# Altium schematic sheet LCL.SchDoc: NIC POWER LCL prototype
size A4; DrawnBy: Marcin Bieda, Daniel Kaczmara; Revision: 1.0
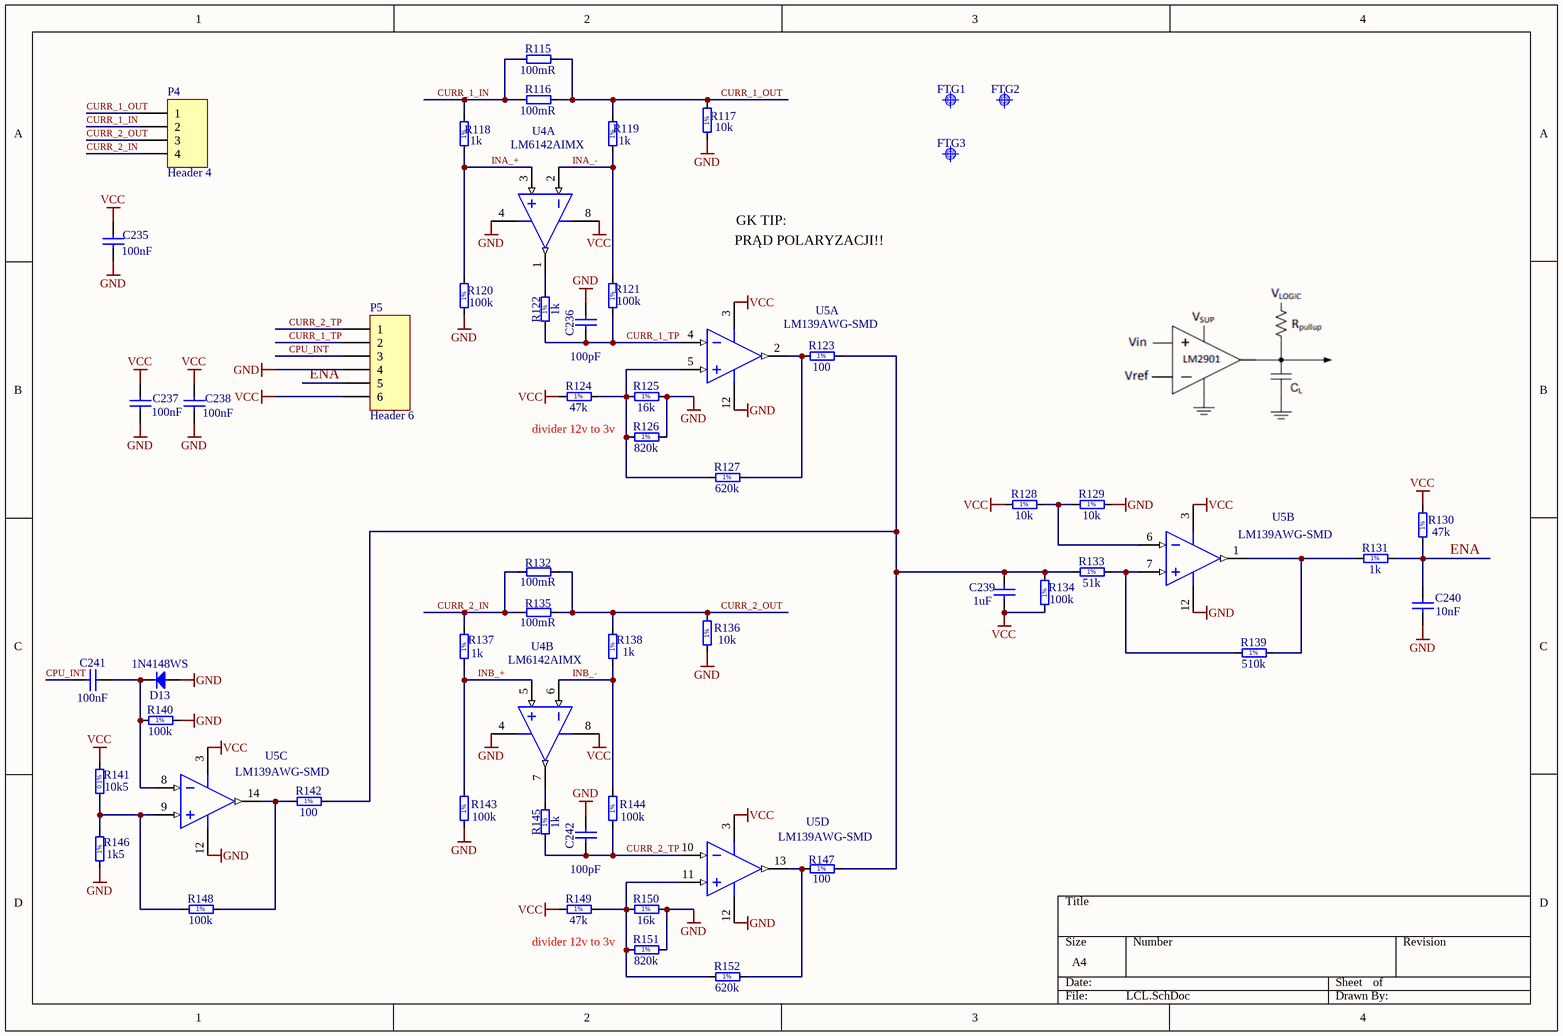
[diagram p0: LCL.SchDoc]

## Parts
C235  100nF  [CAPC1608X87N]
C236  100pF  [CAPC1608X87N]
C237  100nF  [CAPC1608X87N]
C238  100nF  [CAPC1608X87N]
C239  1uF  [CAPC1608X87N]
C240  10nF  [CAPC1608X87N]
C241  100nF  [CAPC1608X87N]
C242  100pF  [CAPC1608X87N]
D13  1N4148WS  [SODFL2512X100N]
FTG1  Use only in PCB  [FIDUCIAL_TOP_C100-200]  (value not drawn)
FTG2  Use only in PCB  [FIDUCIAL_TOP_C100-200]  (value not drawn)
FTG3  Use only in PCB  [FIDUCIAL_TOP_C100-200]  (value not drawn)
P4  Header 4  [1x4 Header 2mm male]
P5  Header 6  [2x3 Header 2mm male]
R115  100mR  [RESC1608X55N]
R116  100mR  [RESC1608X55N]
R117  10k  [RESC1608X55N]
R118  1k  [RESC1608X55N]
R119  1k  [RESC1608X55N]
R120  100k  [RESC1608X55N]
R121  100k  [RESC1608X55N]
R122  1k  [RESC1608X55N]
R123  100  [RESC1608X55N]
R124  47k  [RESC1608X55N]
R125  16k  [RESC1608X55N]
R126  820k  [RESC1608X55N]
R127  620k  [RESC1608X55N]
R128  10k  [RESC1608X55N]
R129  10k  [RESC1608X55N]
R130  47k  [RESC1608X55N]
R131  1k  [RESC1608X55N]
R132  100mR  [RESC1608X55N]
R133  51k  [RESC1608X55N]
R134  100k  [RESC1608X55N]
R135  100mR  [RESC1608X55N]
R136  10k  [RESC1608X55N]
R137  1k  [RESC1608X55N]
R138  1k  [RESC1608X55N]
R139  510k  [RESC1608X55N]
R140  100k  [RESC1608X55N]
R141  10k5  [RESC1608X55N]
R142  100  [RESC1608X55N]
R143  100k  [RESC1608X55N]
R144  100k  [RESC1608X55N]
R145  1k  [RESC1608X55N]
R146  1k5  [RESC1608X55N]
R147  100  [RESC1608X55N]
R148  100k  [RESC1608X55N]
R149  47k  [RESC1608X55N]
R150  16k  [RESC1608X55N]
R151  820k  [RESC1608X55N]
R152  620k  [RESC1608X55N]
U4  LM6142AIMX  [M08A_N]  (parts A,B of 2)
U5  LM139AWG-SMD  [WG14A_N]  (parts A,B,C,D of 4)

## Nets
GND: C235.1 C236.2 C237.1 C238.1 C240.1 C242.2 D13.2(A) P5.4 R117.1 R120.1 R125.2 R126.2 R129.2 R136.1 R140.2 R143.1 R146.1 R150.2 R151.2 U4.4(V-) U5.12(GND)
VCC: C235.2 C237.2 C238.2 C239.1 P5.6 R124.1 R128.1 R130.2 R134.1 R141.2 R149.1 U4.8(V+) U5.3(V+)
CPU_INT: C241.1 P5.3
CURR_1_IN: P4.2 R115.1 R116.1 R118.2
CURR_1_OUT: P4.1 R115.2 R116.2 R117.2 R119.2
CURR_1_TP: C236.1 P5.2 R121.1 R122.1 U5.4(IN1-)
CURR_2_IN: P4.4 R132.1 R135.1 R137.2
CURR_2_OUT: P4.3 R132.2 R135.2 R136.2 R138.2
CURR_2_TP: C242.1 P5.1 R144.1 R145.1 U5.10(IN4-)
ENA: C240.2 P5.5 R130.1 R131.2
INA_+: R118.1 R120.2 U4.3(INA+)
INA_-: R119.1 R121.2 U4.2(INA-)
INB_+: R137.1 R143.2 U4.5(INB+)
INB_-: R138.1 R144.2 U4.6(INB-)
NetC239_2: C239.2 R123.2 R133.1 R134.2 R142.2 R147.2
NetC241_2: C241.2 D13.1(C) R140.1 U5.8(IN3-)
NetR122_2: R122.2 U4.1(OUTA)
NetR123_1: R123.1 R127.2 U5.2(OUT1)
NetR124_2: R124.2 R125.1 R126.1 R127.1 U5.5(IN1+)
NetR128_2: R128.2 R129.1 U5.6(IN2-)
NetR131_1: R131.1 R139.2 U5.1(OUT2)
NetR133_2: R133.2 R139.1 U5.7(IN2+)
NetR141_1: R141.1 R146.2 R148.1 U5.9(IN3+)
NetR142_1: R142.1 R148.2 U5.14(OUT3)
NetR145_2: R145.2 U4.7(OUTB)
NetR147_1: R147.1 R152.2 U5.13(OUT4)
NetR149_2: R149.2 R150.1 R151.1 R152.1 U5.11(IN4+)

## Notes on the sheet
- PRĄD POLARYZACJI!!
- GK TIP:
- (near R126) divider 12v to 3v
- (near R151) divider 12v to 3v
- (in symbol R0603_1K5_1%_0.1W_100PPM) 1%
- (in symbol R0603_1K_1%_0.1W_100PPM) 1%
- (in symbol R0603_10K5_0.1%_0.063W_10PPM) 0.1%
- (in symbol R0603_10K_1%_0.1W_100PPM) 1%
- (in symbol R0603_16K_1%_0.1W_100PPM) 1%
- (in symbol R0603_47K_1%_0.1W_100PPM) 1%
- (in symbol R0603_51K_1%_0.1W_100PPM) 1%
- (in symbol R0603_100K_1%_0.1W_100PPM) 1%
- (in symbol R0603_100R_1%_0.1W_100PPM) 1%
- (in symbol R0603_510K_1%_0.1W_100PPM) 1%
- (in symbol R0603_620K_1%_0.1W_100PPM) 1%
- (in symbol R0603_820K_1%_0.1W_100PPM) 1%

## Library data of the parts
C235 C237 C238 C241 = CC0603_100NF_50V_10%_X7R: Non-polarised capacitor; Part Description: SMD Multilayer Chip Ceramic Capacitor; Manufacturer: GENERIC; Manufacturer1 Part Number: 223858615649; Voltage: 50V; TC: X7R; Tolerance: ±10%; Part Number: CC0603_100NF_50V_10%_X7R; Component Kind: Standard; Component Type: Standard; Pin Count: 2; Value: 100nF; Status: Preferred; Manufacturer Part Number: CC0603_100NF_50V_10%_X7R; Case: 0603; Mounted: Yes; Socket: No; SMD: Yes; Sense: No; Manufacturer1 Example: PHYCOMP; Manufacturer1 ComponentHeight: 0.87mm; HelpURL: \\cern.ch\dfs\Applications\Altium\Datasheets\CC0603_X7R_PHYCOMP.pdf; Author: CERN DEM JLC; CreateDate: 2007-12-03; LatestRevisionDate: 2007-12-03
C236 C242 = CC0603_100PF_50V_10%_X7R: Non-polarised capacitor; Part Description: SMD Multilayer Chip Ceramic Capacitor; Manufacturer: GENERIC; Manufacturer1 Part Number: 223858615609; Voltage: 50V; TC: X7R; Tolerance: ±10%; Part Number: CC0603_100PF_50V_10%_X7R; Component Kind: Standard; Component Type: Standard; Pin Count: 2; Value: 100pF; Status: Preferred; Manufacturer Part Number: CC0603_100PF_50V_10%_X7R; Case: 0603; Mounted: Yes; Socket: No; SMD: Yes; Sense: No; Manufacturer1 Example: PHYCOMP; Manufacturer1 ComponentHeight: 0.9mm; HelpURL: \\cern.ch\dfs\Applications\Altium\Datasheets\CC0603_X7R_PHYCOMP.pdf; Author: CERN DEM JLC; CreateDate: 2012-08-15; LatestRevisionDate: 2012-08-15
C239 = CC0603_1UF_25V_10%_X7R: Non-polarised capacitor; Part Description: SMD Multilayer Chip Ceramic Capacitor; Manufacturer: GENERIC; Manufacturer1 Part Number: GRM188R71E105KA12D; Voltage: 25V; TC: X7R; Tolerance: ±10%; Part Number: CC0603_1UF_25V_10%_X7R; Component Kind: Standard; Component Type: Standard; Pin Count: 2; Value: 1uF; Status: None; Manufacturer Part Number: CC0603_1UF_25V_10%_X7R; Case: 0603; Mounted: Yes; Socket: No; SMD: Yes; Sense: No; Manufacturer1 Example: MURATA; Manufacturer1 ComponentHeight: 0.9mm; HelpURL: \\cern.ch\dfs\Applications\Altium\Datasheets\CC0603_X7R_MURATA.pdf; Author: CERN DEM JLC; CreateDate: 2011-01-18; LatestRevisionDate: 2011-01-18
C240 = CC0603_10NF_50V_10%_X7R: Non-polarised capacitor; Part Description: SMD Multilayer Chip Ceramic Capacitor; Manufacturer: GENERIC; Manufacturer1 Part Number: 223858615636; Voltage: 50V; TC: X7R; Tolerance: ±10%; Part Number: CC0603_10NF_50V_10%_X7R; Component Kind: Standard; Component Type: Standard; Pin Count: 2; Value: 10nF; Status: Preferred; Manufacturer Part Number: CC0603_10NF_50V_10%_X7R; Case: 0603; Mounted: Yes; Socket: No; SMD: Yes; Sense: No; Manufacturer1 Example: PHYCOMP; Manufacturer1 ComponentHeight: 0.87mm; HelpURL: \\cern.ch\dfs\Applications\Altium\Datasheets\CC0603_X7R_PHYCOMP.pdf; Author: CERN DEM JLC; CreateDate: 2007-12-03; LatestRevisionDate: 2007-12-03
D13 = 1N4148WS: Diode; Part Description: Small Signal Diodes; Manufacturer: FAIRCHILD SEMICONDUCTOR; Voltage: 75V; Power: 150mA; PressFit: No; Bonding: No; Part Number: 1N4148WS; Component Kind: Standard; Component Type: Standard; Device: 1N4148WS; PackageDescription: SODFL Diode; 1.70mm W X 1.25mm L X 1.00mm H body, IPC Medium Density; Manufacturer Part Number: 1N4148WS; Pin Count: 2; Case: SOD-323F; Mounted: Yes; Socket: No; SMD: Yes; Sense: No; ComponentHeight: 1mm; HelpURL: \\cern.ch\dfs\Applications\Altium\Datasheets\1N4148WS.pdf; Author: CERN DEM JLC; CreateDate: 2011-05-12; LatestRevisionDate: 2011-05-12
FTG1-FTG3 = FIDUCIAL_TARGET_C100-200: Fiducial Target; Part Description: Round Fiducial Target, Top Layer, 1.0mm, Top Solder 2.0mm, Keepout =2.0mm; Mounted: No; Part Number: FIDUCIAL_TARGET_C100-200; Component Kind: Standard (No BOM); Component Type: Standard (No BOM); Pin Count: 1; Family: Fiducial; Socket: No; SMD: Yes; Sense: No; Status: None; ComponentHeight: 0mm; HelpURL: Undefined; Author: CERN DEM JLC; CreateDate: 2010-02-09; LatestRevisionDate: 2012-04-04; PackageDescription: Round Fiducial Target, Top Layer, 1.0mm, Top Solder 2.0mm, Keepout =2.0mm
P4 = Header 4: Header, 4-Pin; LatestRevisionDate: 17-Jul-2002; LatestRevisionNote: Re-released for DXP Platform.; Publisher: Altium Limited
P5 = Header 6: Header, 6-Pin; LatestRevisionDate: 17-Jul-2002; LatestRevisionNote: Re-released for DXP Platform.; Publisher: Altium Limited
R115 R116 R132 R135 = R0603_0R_JUMPER: Resistor; Part Number: 100mR 0603; Part Description: 1A (0.05R Max DC Resistance) Zero Ohm Jumper; Manufacturer: GENERIC; Manufacturer1 Part Number: NRC06Z0; Value: 0; PressFit: No; Component Kind: Standard; Component Type: Standard; Pin Count: 2; Status: Preferred; Manufacturer Part Number: R0603_0R_JUMPER; Case: 0603; Mounted: Yes; Sense: No; Socket: No; SMD: Yes; Manufacturer1 Example: NIC COMPONENT; Manufacturer1 ComponentHeight: 0.55mm; HelpURL: \\cern.ch\dfs\Applications\Altium\Datasheets\R0603_NIC_NRC.pdf; Author: CERN DEM JLC; CreateDate: 2007-12-03; LatestRevisionDate: 2008-03-13
R117 R128 R129 R136 = R0603_10K_1%_0.1W_100PPM: Resistor - 1%; Part Description: General Purpose Thick Film Chip Resistor; Manufacturer: GENERIC; Manufacturer1 Part Number: NRC06F1002TRF; Power: 0.1W; TC: ±100ppm/°C; PressFit: No; Part Number: R0603_10K_1%_0.1W_100PPM; Component Kind: Standard; Component Type: Standard; Pin Count: 2; Value: 10k; Status: Preferred; Tolerance: ±1%; Manufacturer Part Number: R0603_10K_1%_0.1W_100PPM; Case: 0603; Mounted: Yes; Sense: No; Socket: No; SMD: Yes; Manufacturer1 Example: NIC COMPONENT; Manufacturer1 ComponentHeight: 0.55mm; HelpURL: \\cern.ch\dfs\Applications\Altium\Datasheets\R0603_NIC_NRC.pdf; Author: CERN DEM JLC; CreateDate: 2007-12-03; LatestRevisionDate: 2008-03-13
R118 R119 R122 R131 R137 R138 R145 = R0603_1K_1%_0.1W_100PPM: Resistor - 1%; Part Description: General Purpose Thick Film Chip Resistor; Manufacturer: GENERIC; Manufacturer1 Part Number: NRC06F1001TRF; Power: 0.1W; TC: ±100ppm/°C; PressFit: No; Part Number: R0603_1K_1%_0.1W_100PPM; Component Kind: Standard; Component Type: Standard; Pin Count: 2; Value: 1k; Status: Preferred; Tolerance: ±1%; Manufacturer Part Number: R0603_1K_1%_0.1W_100PPM; Case: 0603; Mounted: Yes; Sense: No; Socket: No; SMD: Yes; Manufacturer1 Example: NIC COMPONENT; Manufacturer1 ComponentHeight: 0.55mm; HelpURL: \\cern.ch\dfs\Applications\Altium\Datasheets\R0603_NIC_NRC.pdf; Author: CERN DEM JLC; CreateDate: 2007-12-03; LatestRevisionDate: 2008-03-13
R120 R121 R134 R140 R143 R144 R148 = R0603_100K_1%_0.1W_100PPM: Resistor - 1%; Part Description: General Purpose Thick Film Chip Resistor; Manufacturer: GENERIC; Manufacturer1 Part Number: NRC06F1003TRF; Power: 0.1W; TC: ±100ppm/°C; PressFit: No; Part Number: R0603_100K_1%_0.1W_100PPM; Component Kind: Standard; Component Type: Standard; Pin Count: 2; Value: 100k; Status: Preferred; Tolerance: ±1%; Manufacturer Part Number: R0603_100K_1%_0.1W_100PPM; Case: 0603; Mounted: Yes; Sense: No; Socket: No; SMD: Yes; Manufacturer1 Example: NIC COMPONENT; Manufacturer1 ComponentHeight: 0.55mm; HelpURL: \\cern.ch\dfs\Applications\Altium\Datasheets\R0603_NIC_NRC.pdf; Author: CERN DEM JLC; CreateDate: 2007-12-03; LatestRevisionDate: 2008-03-13
R123 R142 R147 = R0603_100R_1%_0.1W_100PPM: Resistor - 1%; Part Description: General Purpose Thick Film Chip Resistor; Manufacturer: GENERIC; Manufacturer1 Part Number: NRC06F4700TRF; Power: 0.1W; TC: ±100ppm/°C; PressFit: No; Part Number: R0603_100R_1%_0.1W_100PPM; Component Kind: Standard; Component Type: Standard; Pin Count: 2; Value: 100; Status: Preferred; Tolerance: ±1%; Manufacturer Part Number: R0603_100R_1%_0.1W_100PPM; Case: 0603; Mounted: Yes; Sense: No; Socket: No; SMD: Yes; Manufacturer1 Example: NIC COMPONENT; Manufacturer1 ComponentHeight: 0.55mm; HelpURL: \\cern.ch\dfs\Applications\Altium\Datasheets\R0603_NIC_NRC.pdf; Author: CERN DEM JLC; CreateDate: 2007-12-03; LatestRevisionDate: 2008-03-13
R124 R130 R149 = R0603_47K_1%_0.1W_100PPM: Resistor - 1%; Part Description: General Purpose Thick Film Chip Resistor; Manufacturer: GENERIC; Manufacturer1 Part Number: NRC06F4702TRF; Power: 0.1W; TC: ±100ppm/°C; PressFit: No; Part Number: R0603_47K_1%_0.1W_100PPM; Component Kind: Standard; Component Type: Standard; Pin Count: 2; Value: 47k; Status: Preferred; Tolerance: ±1%; Manufacturer Part Number: R0603_47K_1%_0.1W_100PPM; Case: 0603; Mounted: Yes; Sense: No; Socket: No; SMD: Yes; Manufacturer1 Example: NIC COMPONENT; Manufacturer1 ComponentHeight: 0.55mm; HelpURL: \\cern.ch\dfs\Applications\Altium\Datasheets\R0603_NIC_NRC.pdf; Author: CERN DEM JLC; CreateDate: 2007-12-03; LatestRevisionDate: 2008-03-13
R125 R150 = R0603_16K_1%_0.1W_100PPM: Resistor - 1%; Part Description: General Purpose Thick Film Chip Resistor; Manufacturer: GENERIC; Manufacturer1 Part Number: NRC06F1602TRF; Power: 0.1W; TC: ±100ppm/°C; PressFit: No; Part Number: R0603_16K_1%_0.1W_100PPM; Component Kind: Standard; Component Type: Standard; Pin Count: 2; Value: 16k; Status: Preferred; Tolerance: ±1%; Manufacturer Part Number: R0603_16K_1%_0.1W_100PPM; Case: 0603; Mounted: Yes; Sense: No; Socket: No; SMD: Yes; Manufacturer1 Example: NIC COMPONENT; Manufacturer1 ComponentHeight: 0.55mm; HelpURL: \\cern.ch\dfs\Applications\Altium\Datasheets\R0603_NIC_NRC.pdf; Author: CERN DEM JLC; CreateDate: 2007-12-03; LatestRevisionDate: 2008-03-13
R126 R151 = R0603_820K_1%_0.1W_100PPM: Resistor - 1%; Part Description: General Purpose Thick Film Chip Resistor; Manufacturer: GENERIC; Manufacturer1 Part Number: NRC06F8203TRF; Power: 0.1W; TC: ±100ppm/°C; PressFit: No; Part Number: R0603_820K_1%_0.1W_100PPM; Component Kind: Standard; Component Type: Standard; Pin Count: 2; Value: 820k; Status: Preferred; Tolerance: ±1%; Manufacturer Part Number: R0603_820K_1%_0.1W_100PPM; Case: 0603; Mounted: Yes; Sense: No; Socket: No; SMD: Yes; Manufacturer1 Example: NIC COMPONENT; Manufacturer1 ComponentHeight: 0.55mm; HelpURL: \\cern.ch\dfs\Applications\Altium\Datasheets\R0603_NIC_NRC.pdf; Author: CERN DEM JLC; CreateDate: 2007-12-03; LatestRevisionDate: 2008-03-13
R127 R152 = R0603_620K_1%_0.1W_100PPM: Resistor - 1%; Part Description: General Purpose Thick Film Chip Resistor; Manufacturer: GENERIC; Manufacturer1 Part Number: NRC06F6203TRF; Power: 0.1W; TC: ±100ppm/°C; PressFit: No; Part Number: R0603_620K_1%_0.1W_100PPM; Component Kind: Standard; Component Type: Standard; Pin Count: 2; Value: 620k; Status: Preferred; Tolerance: ±1%; Manufacturer Part Number: R0603_620K_1%_0.1W_100PPM; Case: 0603; Mounted: Yes; Sense: No; Socket: No; SMD: Yes; Manufacturer1 Example: NIC COMPONENT; Manufacturer1 ComponentHeight: 0.55mm; HelpURL: \\cern.ch\dfs\Applications\Altium\Datasheets\R0603_NIC_NRC.pdf; Author: CERN DEM JLC; CreateDate: 2007-12-03; LatestRevisionDate: 2008-03-13
R133 = R0603_51K_1%_0.1W_100PPM: Resistor - 1%; Part Description: General Purpose Thick Film Chip Resistor; Manufacturer: GENERIC; Manufacturer1 Part Number: NRC06F5102TRF; Power: 0.1W; TC: ±100ppm/°C; PressFit: No; Part Number: R0603_51K_1%_0.1W_100PPM; Component Kind: Standard; Component Type: Standard; Pin Count: 2; Value: 51k; Status: Preferred; Tolerance: ±1%; Manufacturer Part Number: R0603_51K_1%_0.1W_100PPM; Case: 0603; Mounted: Yes; Sense: No; Socket: No; SMD: Yes; Manufacturer1 Example: NIC COMPONENT; Manufacturer1 ComponentHeight: 0.55mm; HelpURL: \\cern.ch\dfs\Applications\Altium\Datasheets\R0603_NIC_NRC.pdf; Author: CERN DEM JLC; CreateDate: 2007-12-03; LatestRevisionDate: 2008-03-13
R139 = R0603_510K_1%_0.1W_100PPM: Resistor - 1%; Part Description: General Purpose Thick Film Chip Resistor; Manufacturer: GENERIC; Manufacturer1 Part Number: NRC06F5103TRF; Power: 0.1W; TC: ±100ppm/°C; PressFit: No; Part Number: R0603_510K_1%_0.1W_100PPM; Component Kind: Standard; Component Type: Standard; Pin Count: 2; Value: 510k; Status: Preferred; Tolerance: ±1%; Manufacturer Part Number: R0603_510K_1%_0.1W_100PPM; Case: 0603; Mounted: Yes; Sense: No; Socket: No; SMD: Yes; Manufacturer1 Example: NIC COMPONENT; Manufacturer1 ComponentHeight: 0.55mm; HelpURL: \\cern.ch\dfs\Applications\Altium\Datasheets\R0603_NIC_NRC.pdf; Author: CERN DEM JLC; CreateDate: 2007-12-03; LatestRevisionDate: 2008-03-13
R141 = R0603_10K5_0.1%_0.063W_10PPM: Resistor - 0.1%; Part Description: Thin Film Chip Resistor; Manufacturer: GENERIC; Manufacturer1 Part Number: RN73C1J10K5BTDF; Power: 0.063W; TC: ±10ppm; PressFit: No; Part Number: R0603_10K5_0.1%_0.063W_10PPM; Component Kind: Standard; Component Type: Standard; Pin Count: 2; Value: 10k5; Status: Not Recommended; Tolerance: ±0.1%; Manufacturer Part Number: R0603_10K5_0.1%_0.063W_10PPM; Case: 0603; Mounted: Yes; Sense: No; Socket: No; SMD: Yes; Manufacturer1 Example: TYCO HOLSWORTHY; Manufacturer1 ComponentHeight: 0.5mm; HelpURL: \\cern.ch\dfs\Applications\Altium\Datasheets\R0603_Tyco_RN73.pdf; Author: CERN DEM JLC; CreateDate: 2007-12-03; LatestRevisionDate: 2008-03-13
R146 = R0603_1K5_1%_0.1W_100PPM: Resistor - 1%; Part Description: General Purpose Thick Film Chip Resistor; Manufacturer: GENERIC; Manufacturer1 Part Number: NRC06F1501TRF; Power: 0.1W; TC: ±100ppm/°C; PressFit: No; Part Number: R0603_1K5_1%_0.1W_100PPM; Component Kind: Standard; Component Type: Standard; Pin Count: 2; Value: 1k5; Status: Preferred; Tolerance: ±1%; Manufacturer Part Number: R0603_1K5_1%_0.1W_100PPM; Case: 0603; Mounted: Yes; Sense: No; Socket: No; SMD: Yes; Manufacturer1 Example: NIC COMPONENT; Manufacturer1 ComponentHeight: 0.55mm; HelpURL: \\cern.ch\dfs\Applications\Altium\Datasheets\R0603_NIC_NRC.pdf; Author: CERN DEM JLC; CreateDate: 2007-12-03; LatestRevisionDate: 2008-03-13
U4 = LM6142AIMX: Dual High Speed/Low Power 17 MHz Rail-to-Rail I/O Operational Amplifier, 8-pin Narrow SOIC; Manufacturer: National Semiconductor; PackageTopMarking: NSZXTT*LM614*2AIM; PowerWise: N; CompType: Amplifiers; High-Reliability: Y; DatasheetVersion: Nov-2004; PackageVersion: revM, May-2009; PackageReference: M08A; PackageDescription: SOIC Narrow, 4.9 x 3.9 x 1.45mm, 8 Lead, 1.27mm Pitch; PartNumber: LM6142AIMX; RoHS: N; PinCount: 8; Code_JEDEC: MS-012-AA; Code_IPC: SOIC127P600-8; ComponentLink1Description: Manufacturer URL; ComponentLink1URL: http://www.national.com/; ComponentLink2Description: LM6142 Datasheet; ComponentLink2URL: http://www.national.com/ds/LM/LM6142.pdf; ComponentLink3Description: LM6142 Web Page; ComponentLink3URL: http://www.national.com/pf/LM/LM6142.html; ComponentLink4Description: M08A Package Page; ComponentLink4URL: http://www.national.com/packaging/folders/m08a.html
U5 = LM139AWG-SMD: Low Power Low Offset Voltage Quad Comparator, 14-pin CerPACK; Manufacturer: National Semiconductor; PackageTopMarking: NSZSSXXYYA*5962-*8773901XA Q; PowerWise: N; CompType: Amplifiers; High-Reliability: Y; DatasheetVersion: Mar-2004; PackageVersion: revD, Jul-2007; PackageReference: WG14A; PackageDescription: Cerpack, .390 x .250 x .070in, 14 Lead, .050in Pitch, Gull Wing; PartNumber: LM139AWG-SMD; RoHS: N; PinCount: 14; ComponentLink1Description: Manufacturer URL; ComponentLink1URL: http://www.national.com/; ComponentLink2Description: LM139A Datasheet; ComponentLink2URL: http://www.national.com/ds/LM/LM139AQML.pdf; ComponentLink3Description: LM139A Web Page; ComponentLink3URL: http://www.national.com/pf/LM/LM139A.html; ComponentLink4Description: WG14A Package Page; ComponentLink4URL: http://www.national.com/packaging/folders/wg14a.html